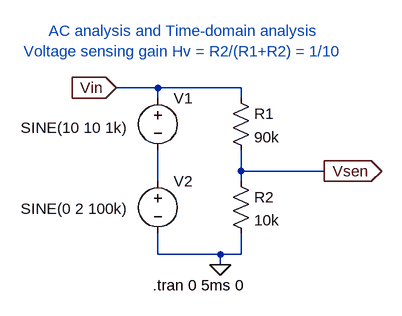
[diagram p0: schematic AC Analysis of Voltage Divider.asc]
AC Analysis of Voltage Divider.asc, the LTspice schematic file:
Version 4
SHEET 1 916 680
WIRE 400 192 336 192
WIRE 528 192 400 192
WIRE 400 208 400 192
WIRE 528 208 528 192
WIRE 528 320 528 288
WIRE 656 320 528 320
WIRE 400 336 400 288
WIRE 528 336 528 320
WIRE 400 448 400 416
WIRE 496 448 400 448
WIRE 528 448 528 416
WIRE 528 448 496 448
WIRE 496 464 496 448
FLAG 496 464 0
FLAG 656 320 Vsen
IOPIN 656 320 Out
FLAG 336 192 Vin
IOPIN 336 192 In
SYMBOL voltage 400 192 R0
WINDOW 123 0 0 Left 2
WINDOW 39 0 0 Left 2
WINDOW 3 -211 61 Left 2
SYMATTR Value SINE(10 10 1k)
SYMATTR InstName V1
SYMBOL res 512 192 R0
SYMATTR InstName R1
SYMATTR Value 90k
SYMBOL res 512 320 R0
SYMATTR InstName R2
SYMATTR Value 10k
SYMBOL voltage 400 320 R0
WINDOW 123 0 0 Left 2
WINDOW 39 0 0 Left 2
WINDOW 3 -211 58 Left 2
SYMATTR Value SINE(0 2 100k)
SYMATTR InstName V2
TEXT 392 496 Left 2 !.tran 0 5ms 0
TEXT 440 120 Center 2 ;AC analysis and Time-domain analysis\nVoltage sensing gain Hv = R2/(R1+R2) = 1/10

The netlist it stands for:
* AC Analysis of Voltage Divider.asc
V1 Vin N001 SINE(10 10 1k)
R1 Vin Vsen 90k
R2 Vsen 0 10k
V2 N001 0 SINE(0 2 100k)
.tran 0 5ms 0
* AC analysis and Time-domain analysis
* Voltage sensing gain Hv = R2/(R1+R2) = 1/10
.backanno
.end